# EAGLE design main (EAGLE 7.6.0)
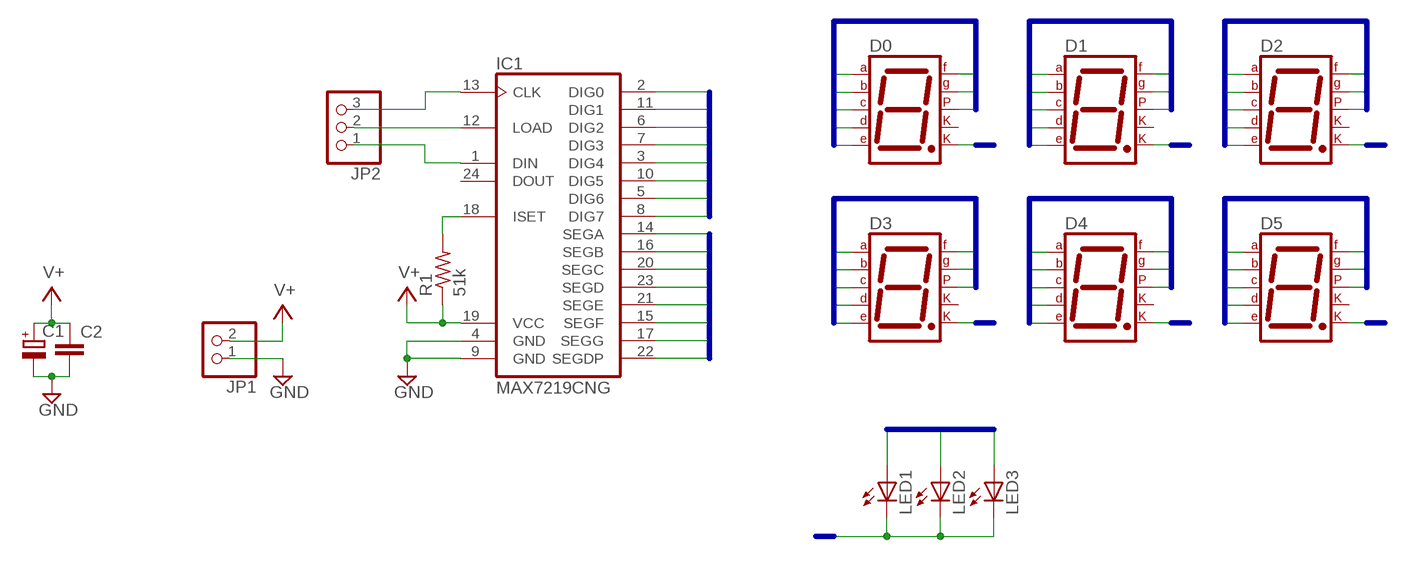
[diagram p0: schematic, sheet 1]

## Parts
C1  CPOL-EUE2-5  [E2-5]
C2  C-EU050-025X075  [C050-025X075]
D0  7SEG-CK  [7SEG-13]
D1  7SEG-CK  [7SEG-13]
D2  7SEG-CK  [7SEG-13]
D3  7SEG-CK  [7SEG-13]
D4  7SEG-CK  [7SEG-13]
D5  7SEG-CK  [7SEG-13]
IC1  MAX7219CNG  [DIL24-3]
JP1  PINHD-1X2  [1X02]
JP2  PINHD-1X3  [1X03]
LED1  LED3MM  [LED3MM]
LED2  LED3MM  [LED3MM]
LED3  LED3MM  [LED3MM]
R1  51k  R-US_R0603  [R0603]

## Nets
DIG0: D0.8(CK2) IC1.2(DIG0)
DIG1: D1.8(CK2) IC1.11(DIG1)
DIG2: D2.8(CK2) IC1.6(DIG2)
DIG3: D3.8(CK2) IC1.7(DIG3)
DIG4: D4.8(CK2) IC1.3(DIG4)
DIG5: D5.8(CK2) IC1.10(DIG5)
DIG6: IC1.5(DIG6) LED1.K(C) LED2.K(C) LED3.K(C)
DIG7: IC1.8(DIG7)
GND: C1.- C2.2 IC1.4(GND) IC1.9(GND) JP1.1
N$1: IC1.18(ISET) R1.2
N$2: IC1.13(CLK) JP2.3
N$3: IC1.12(LOAD) JP2.2
N$4: IC1.1(DIN) JP2.1
SEG0: D0.7(A) D1.7(A) D2.7(A) D3.7(A) D4.7(A) D5.7(A) IC1.14(SEGA) LED1.A
SEG1: D0.6(B) D1.6(B) D2.6(B) D3.6(B) D4.6(B) D5.6(B) IC1.16(SEGB) LED2.A
SEG2: D0.4(C) D1.4(C) D2.4(C) D3.4(C) D4.4(C) D5.4(C) IC1.20(SEGC) LED3.A
SEG3: D0.2(D) D1.2(D) D2.2(D) D3.2(D) D4.2(D) D5.2(D) IC1.23(SEGD)
SEG4: D0.1(E) D1.1(E) D2.1(E) D3.1(E) D4.1(E) D5.1(E) IC1.21(SEGE)
SEG5: D0.9(F) D1.9(F) D2.9(F) D3.9(F) D4.9(F) D5.9(F) IC1.15(SEGF)
SEG6: D0.10(G) D1.10(G) D2.10(G) D3.10(G) D4.10(G) D5.10(G) IC1.17(SEGG)
SEG7: D0.5(DP) D1.5(DP) D2.5(DP) D3.5(DP) D4.5(DP) D5.5(DP) IC1.22(SEGDP)
V+: C1.+ C2.1 IC1.19(VCC) JP1.2 R1.1
Unconnected: D0.3(CK1) D1.3(CK1) D2.3(CK1) D3.3(CK1) D4.3(CK1) D5.3(CK1) IC1.24(DOUT)

## Buses
SEG[0..7]
DIG[0..7]

## Library data of the parts
C1 = rcl:CPOL-EU: POLARIZED CAPACITOR, European symbol
C2 = rcl:C-EU: CAPACITOR, European symbol
D0 D1-D5 = special:7SEG-CK: 7-segment DISPLAY single cathode, 13 mm
IC1 = maxim:MAX7219CNG: LED DISPLAY DRIVER; MF: MAXIM; MPN: MAX7219CNG; OC_FARNELL: 1523914; OC_NEWARK: 34C4018
JP1 = pinhead:PINHD-1X2: PIN HEADER
JP2 = pinhead:PINHD-1X3: PIN HEADER
LED1-LED3 = adafruit:LED: LED OSRAM: - CHIPLED LG R971, LG N971, LY N971, LG Q971, LY Q971, LO R971, LY R971 LH N974, LH R974 LS Q976, LO Q976, LY Q976 LO Q996 - Hyper CHIPLED LW Q18S LB Q993, LB Q99A, LB R99A - SideLED LS A670, LO A670, LY A670, LG A670, LP A670 LB A673, LV A673, LT A673, LW A673 LH A674 LY A675 LS A676, LA A676, LO A676, LY A676, LW A676 LS A679, LY A679, LG A679 - Hyper Micro SIDELED® LS Y876, LA Y876, LO Y876, LY Y876 LT Y87S - SmartLED LW L88C, LW L88S LB L89C, LB L89S, LG L890 LS L89K, LO L89K, LY L89K LS L896, LA L896, LO L896, LY L896 - TOPLED LS T670, LO T670, LY T670, LG T670, LP T670 LSG T670, LSP T670, LSY T670, LOP T670, LYG T670 LG T671, LOG T671, LSG T671 LB T673, LV T673, LT T673, LW T673 LH T674 LS T676, LA T676, LO T676, LY T676, LB T676, LH T676, LSB T676, LW T676 LB T67C, LV T67C, LT T67C, LS T67K, LO T67K, LY T67K, LW E67C LS E67B, LA E67B, LO E67B, LY E67B, LB E67C, LV E67C, LT E67C LW T67C LS T679, LY T679, LG T679 LS T770, LO T770, LY T770, LG T770, LP T770 LB T773, LV T773, LT T773, LW T773 LH T774 LS E675, LA E675, LY E675, LS T675 LS T776, LA T776, LO T776, LY T776, LB T776 LHGB T686 LT T68C, LB T68C - Hyper Mini TOPLED® LB M676 - Mini TOPLED Santana® LG M470 LS M47K, LO M47K, LY M47K Source: http://www.osram.convergy.de/
R1 = adafruit:R-US_: RESISTOR, American symbol

## Board
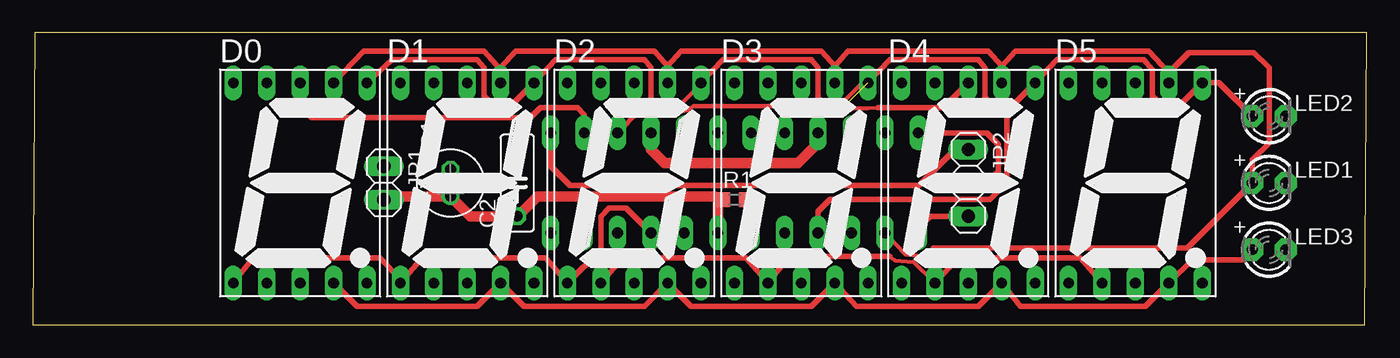
[diagram p1: board, top side]
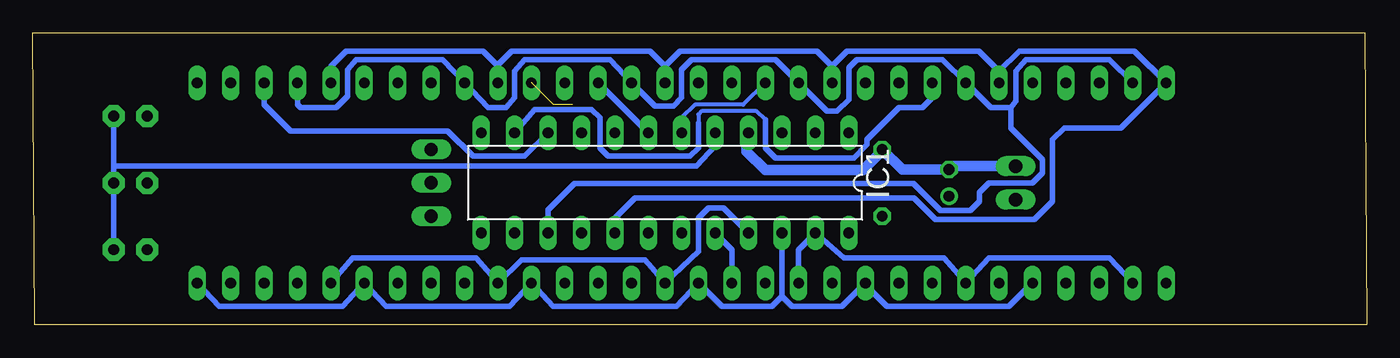
[diagram p2: board, bottom side, seen from below]

Size 101.4 x 22.21 mm. Coordinates in mm from the lower left corner, seen from the top.
Outline: 0,0 101.27,0 101.4,22.21 0.13,22.21 0,0
Copper layers (1*16): Top 0.035mm / dielectric 1.5mm / Bottom 0.035mm
Design rules "default": minimum track width 10mil, minimum drill 24mil, track to track 8mil, track to pad 8mil, pad to pad 8mil, via to via 8mil, smd to smd 8mil, copper to edge 40mil, drill to drill 8mil, minimum pad ring 10mil, minimum via ring 8mil, stop-mask expansion 4mil, vias tented up to drill 0mil, thermal gap 10mil

### Footprints (pad centres in the part's own frame; a part is rotated, then mirrored left to right if it is on the bottom)
E2-5 = drill 0.813 pad 1.27: + -1.016,0 | drill 0.813 pad 1.27 octagon: - 1.016,0
C050-025X075 = drill 0.813 octagon: 1 -2.54,0; 2 2.54,0
7SEG-13 = drill 0.813 long: 1 -5.08,-7.62; 2 -2.54,-7.62; 3 0,-7.62; 4 2.54,-7.62; 5 5.08,-7.62; 6 5.08,7.62; 7 2.54,7.62; 8 0,7.62; 9 -2.54,7.62; 10 -5.08,7.62
DIL24-3 = drill 0.813 long: 1 -13.97,-3.81; 2 -11.43,-3.81; 3 -8.89,-3.81; 4 -6.35,-3.81; 5 -3.81,-3.81; 6 -1.27,-3.81; 7 1.27,-3.81; 8 3.81,-3.81; 9 6.35,-3.81; 10 8.89,-3.81; 11 11.43,-3.81; 12 13.97,-3.81; 13 13.97,3.81; 14 11.43,3.81; 15 8.89,3.81; 16 6.35,3.81; 17 3.81,3.81; 18 1.27,3.81; 19 -1.27,3.81; 20 -3.81,3.81; 21 -6.35,3.81; 22 -8.89,3.81; 23 -11.43,3.81; 24 -13.97,3.81
1X02 = drill 1.016 long: 1 -1.27,0; 2 1.27,0
1X03 = drill 1.016 long: 1 -2.54,0; 2 0,0; 3 2.54,0
LED3MM = drill 0.813 pad 1.676 octagon: A -1.27,0; K 1.27,0
R0603 = smd 1 x 1.1: 1 -0.85,0; 2 0.85,0

### Placement (x,y rotation side)
C1  31.75,10.79 90 top
C2  36.83,10.79 90 top
D0  20.32,10.79 0 top
D1  33.02,10.79 0 top
D2  45.72,10.79 0 top
D3  58.42,10.79 0 top
D4  71.12,10.79 0 top
D5  83.82,10.79 0 top
IC1  53.34,10.79 180 bottom
JP1  26.67,10.79 270 top
JP2  71.12,10.79 270 top
LED1  93.98,10.79 0 top
LED2  93.98,15.88 0 top
LED3  93.98,5.71 0 top
R1  53.34,9.53 0 top

### Tracks (layer width: path | path; a pad name or v marks a point on that pad's centre or on a via)
DIG0
  Top 0.406: D0.8 20.32,16.64 21.21,15.75 37.85,15.75 38.61,16.51 41.4,16.51 41.91,16 IC1.2
DIG1
  Bottom 0.305: 45.72,15.62 46.38,16.26 50.57,16.26 50.8,16 50.8,15.37
  Bottom 0.406: D1.8 33.02,17.27 33.78,16.51 35.56,16.51 37.97,14.1 37.97,13.72 38.99,12.7 44.96,12.7 45.72,13.46 45.72,15.62 | 50.8,15.37 50.8,13.46 51.44,12.83 57.66,12.83 58.29,13.46 58.29,15.75 58.93,16.38 63.25,16.38 IC1.11
DIG2
  Bottom 0.305: D2.8 47.4,16.74 51.05,16.74 52.07,15.75 52.07,15.49
  Bottom 0.356: 52.07,15.49 IC1.6
DIG3
  Bottom 0.406: IC1.7 D3.8
DIG4
  Top 0.305: 59.05,16.64 59.54,16.64 59.97,16.28 60.5,16 61.39,15.98 62.13,16.48 63.48,16.48 64.26,16.51 | 46.08,16.26 46.23,16.41 46.84,16.41 47.47,16.18 48.92,16.18 49.78,16.33
  Top 0.356: IC1.3 46.08,16.26 | 59.05,16.64 50.24,16.64 49.78,16.33
  Top 0.406: 64.26,16.51 69.22,16.51 D4.8
DIG5
  Bottom 0.406: IC1.10 64.01,12.83 67.95,12.83 69.85,14.73 81.79,14.73 83.82,16.76 D5.8
DIG6
  Bottom 0.406: IC1.5 49.53,13.59 50.93,12.06 95.25,12.06 | LED3.K LED1.K 95.25,12.06 | 95.25,12.06 LED2.K
GND
  Top 0.813: IC1.9 59.69,13.84 58.17,12.32 48.01,12.32 46.99,13.33 IC1.4
  Bottom 0.813: JP1.1 31.5,12.06 C1.- 35.31,11.81 C2.2 36.83,13.23 38.3,11.76 45.72,11.76 47.14,13.18 47.14,14.45 IC1.4
N$1
  Top 0.813: IC1.18 54.61,9.11 R1.2
N$2
  Top 0.406: IC1.13 67.31,7.37 68.2,8.25 JP2.3
N$3
  Top 0.406: IC1.12 72.52,14.6 73.41,13.72 73.41,11.68 72.52,10.79 JP2.2
N$4
  Top 0.406: IC1.1 39.37,12.06 40.84,10.59 67.36,10.59 70.1,13.33 JP2.1
SEG0
  Top 0.305: IC1.14 66.32,5.36 67.79,5.26 68.45,5.84
  Top 0.406: D0.7 25.15,20.83 34.29,20.83 35.56,19.43 D1.7 35.56,19.56 36.7,20.83 47.24,20.83 48.26,19.69 | D2.7 48.26,19.69 | 48.26,19.69 49.28,20.83 59.94,20.83 60.96,19.69 | D3.7 60.96,19.69 | 60.96,19.69 61.98,20.83 72.64,20.83 73.66,19.69 | 73.66,19.69 74.68,20.83 84.84,20.83 86.36,19.18 | 73.66,19.69 D4.7 | D5.7 86.36,19.18 | 86.36,19.18 87.88,20.7 92.84,20.7 93.98,19.56 93.98,13.84 92.71,12.57 LED1.A 87.76,5.84 68.45,5.84
SEG1  (2 unrouted)
  Top 0.305: 46.99,17.25 46.99,17.14 47.4,16.76 47.42,16.74 49.2,16.74 49.23,16.76 50.34,17.86 50.34,17.96 D2.6 | 59.69,17.4 59.69,17.37 60.32,16.74 61.39,16.74 62.89,18.24 63.32,18.24 D3.6
  Top 0.356: 46.99,17.27 46.99,17.25
  Top 0.406: D0.6 27.3,20.19 33.78,20.19 34.29,19.56 34.29,17.4 35.18,16.51 36.2,16.51 D1.6 39.75,20.19 46.48,20.19 46.99,19.56 46.99,17.27 | D2.6 52.45,20.19 59.18,20.19 59.69,19.56 59.69,17.4 | D3.6 65.15,20.19 71.88,20.19 72.39,19.56 72.39,17.27 73.03,16.64 73.91,16.64 | 73.91,16.64 74.42,16.64 D4.6 77.85,20.19 84.45,20.19 85.09,19.43 85.09,17.4 85.85,16.64 87.12,16.64 D5.6 90.17,18.42 LED2.A | IC1.16 59.69,8.64 60.58,9.53 72.77,9.53 74.04,10.79 74.04,16.51 73.91,16.64
SEG2
  Top 0.406: D0.4 24.64,1.4 33.78,1.4 D1.4 37.34,1.4 46.48,1.4 D2.4 50.04,1.4 59.18,1.4 D3.4 62.61,1.4 71.88,1.4 D4.4 75.06,1.4 84.56,1.4 D5.4 88.14,4.95 91.95,4.95 LED3.A
  Bottom 0.406: D2.4 48.26,5.71 IC1.20
SEG3
  Top 0.305: 65.15,5.21 65.53,4.9 66.95,4.8 D4.2
  Top 0.406: D2.2 44.83,5.08 54.23,5.08 D3.2 57.53,5.21 65.15,5.21 | D4.2 70.36,5.08 79.63,5.08 D5.2
  Bottom 0.406: D2.2 43.18,5.71 IC1.23 39.75,5.08 32.13,5.08 D1.2 28.7,5.08 19.56,5.08 D0.2
SEG4
  Top 0.406: D0.1 16.76,5.08 26.42,5.08 27.94,3.43 D1.1 29.59,5.08 38.99,5.08 D2.1 43.18,5.71 43.18,8.25 43.81,8.89 45.09,8.89 IC1.21
  Bottom 0.406: IC1.21 48.89,8.89 50.04,8.89 50.8,8.13 50.8,5.59 D3.1 54.86,4.95 64.26,4.95 D4.1 67.69,5.08 77.09,5.08 D5.1
SEG5
  Bottom 0.406: D5.9 81.28,16.76 81.03,16.51 78.36,16.51 77.47,17.4 77.47,19.43 76.84,20.19 70.23,20.19 D4.9 66.8,16.51 65.41,16.51 64.77,17.27 64.77,19.3 64.01,20.19 57.53,20.19 D3.9 54.1,16.64 52.7,16.64 52.07,17.27 52.07,19.43 51.31,20.19 44.96,20.19 D2.9 41.02,16.26 40.26,16.26 39.37,17.14 39.37,19.56 38.73,20.19 32.26,20.19 D1.9 28.58,16.51 27.05,16.51 | D0.9 19.56,20.19 25.91,20.19 26.67,19.3 26.67,17.02 27.05,16.51 | IC1.15 62.23,8.76 62.2,8.76 60.22,10.74 34.47,10.74 32.41,8.69 30.12,8.69 29.44,9.37 29.44,10.06 28.7,10.79 25.4,10.79 24.64,11.56 24.64,12.57 27.05,14.99 27.05,16.51
SEG6
  Bottom 0.406: 27.94,19.3 26.42,20.83 17.65,20.83 D0.10 18.67,14.99 22.99,14.99 23.88,14.1 23.88,9.4 25.27,8 32.77,8 34.42,9.65 55.63,9.65 57.15,8.13 IC1.17 | D1.10 27.94,19.3 | 27.94,19.3 29.46,20.83 39.5,20.83 40.64,19.69 | D2.10 40.64,19.69 | 40.64,19.69 41.78,20.83 52.2,20.83 53.34,19.69 | D3.10 53.34,19.69 | 53.34,19.69 54.48,20.83 65.02,20.83 66.04,19.81 D4.10 66.04,19.69 67.18,20.83 77.6,20.83 78.74,19.69 D5.10
SEG7
  Bottom 0.406: 44.45,2.16 45.21,1.4 49.02,1.4 D2.5 52.45,1.4 61.85,1.4 D3.5 65.15,1.4 74.55,1.4 D4.5 77.85,1.4 87.25,1.4 D5.5 | 44.45,2.16 IC1.22 | 44.45,2.16 43.69,1.4 39.88,1.4 D1.5 38.1,3.05 36.45,1.4 27.18,1.4 D0.5
V+
  Top 0.813: IC1.19 52.07,9.11 | 52.07,9.11 R1.1 | 52.07,9.11 52.07,9.53 51.82,9.78 38.35,9.78 C2.1 33.27,8.25 C1.+ 26.92,9.78 JP1.2